# EAGLE design RAMPSXB (EAGLE 8.1.1)
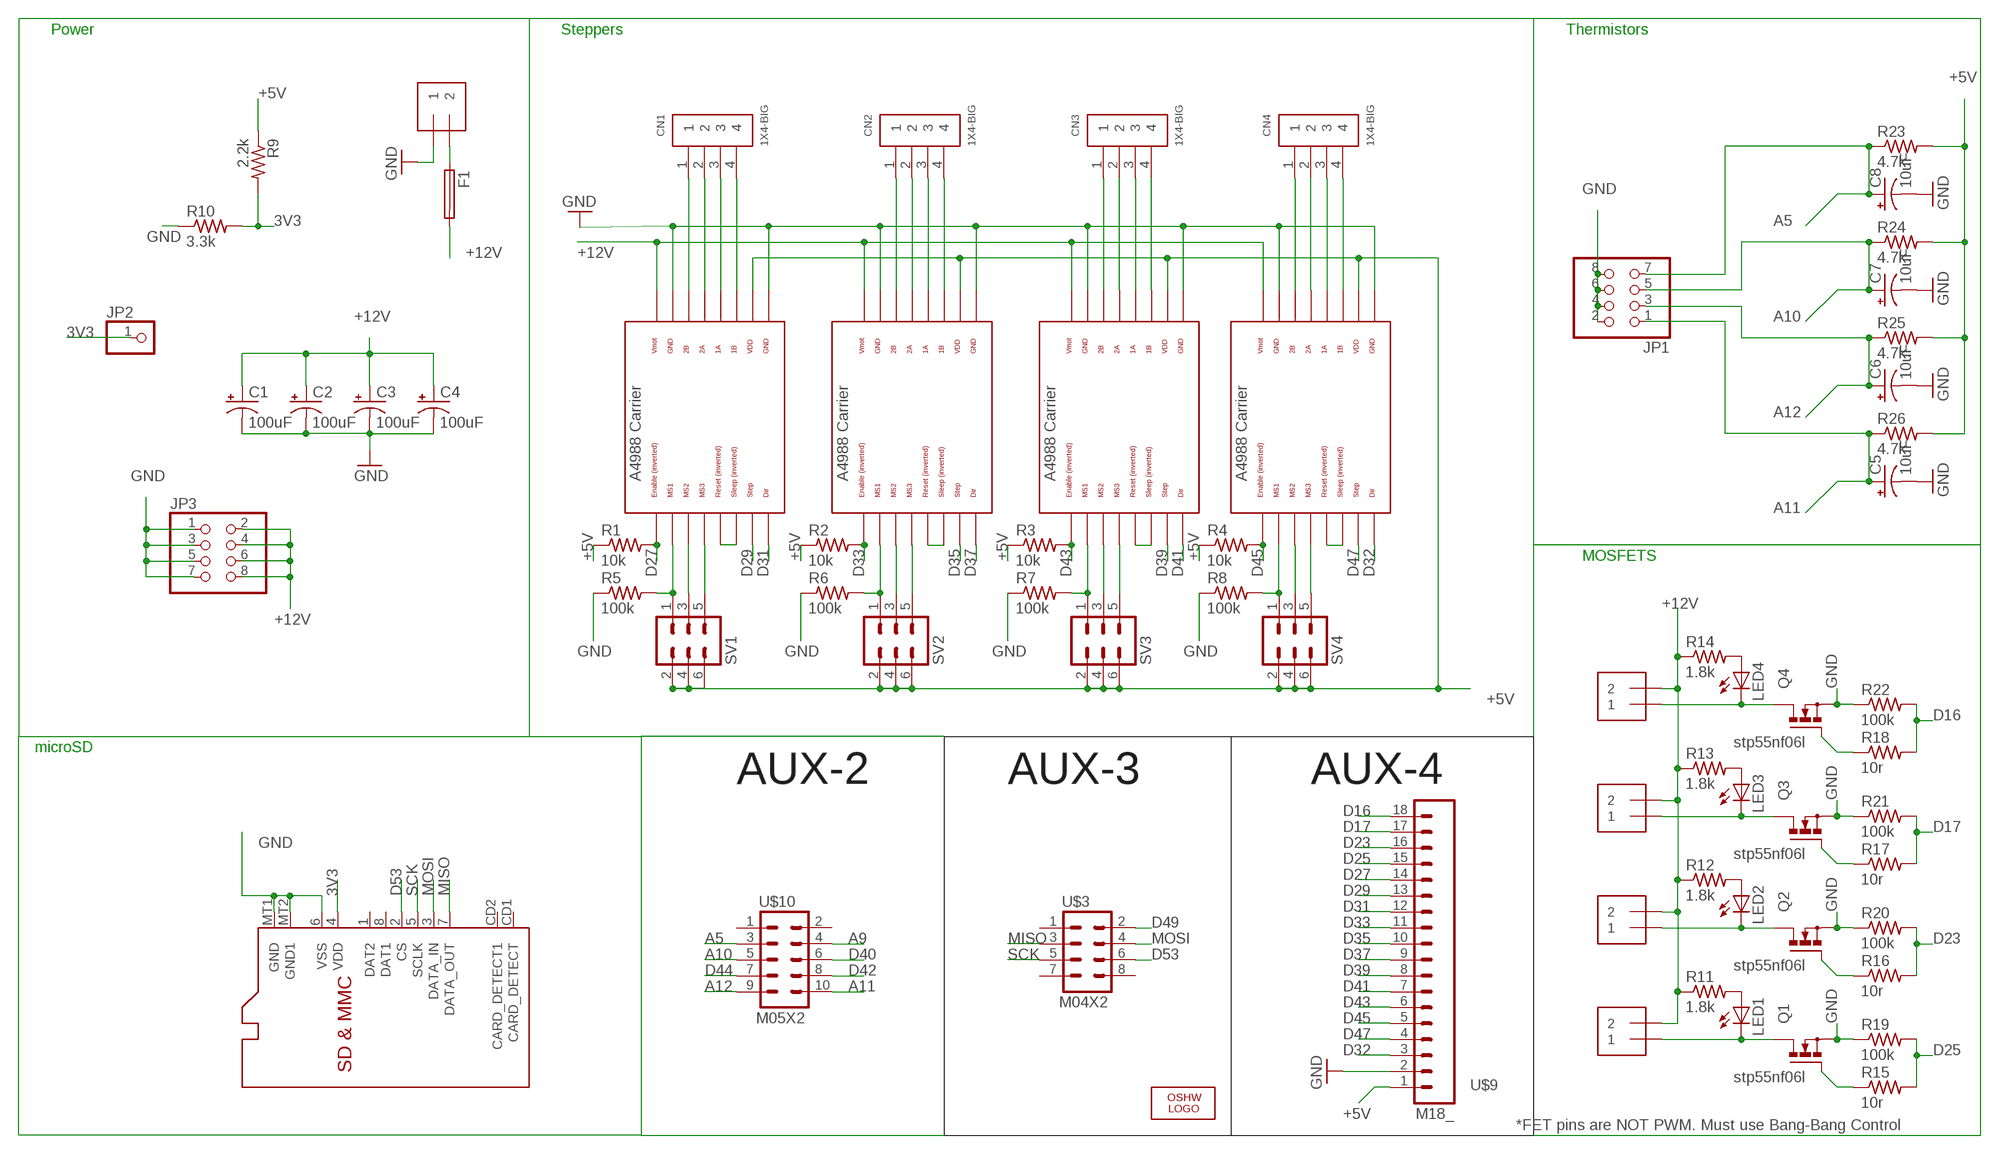
[diagram p0: schematic, sheet 1]

## Parts
C1  100uF  CPOL-US153CLV-0605  [153CLV-0605]
C2  100uF  CPOL-US153CLV-0605  [153CLV-0605]
C3  100uF  CPOL-US153CLV-0605  [153CLV-0605]
C4  100uF  CPOL-US153CLV-0605  [153CLV-0605]
C5  10uF  CPOL-US153CLV-0405  [153CLV-0405]
C6  10uF  CPOL-US153CLV-0405  [153CLV-0405]
C7  10uF  CPOL-US153CLV-0405  [153CLV-0405]
C8  10uF  CPOL-US153CLV-0405  [153CLV-0405]
CN1  1X4-BIG  [1X04-BIG]
CN2  1X4-BIG  [1X04-BIG]
CN3  1X4-BIG  [1X04-BIG]
CN4  1X4-BIG  [1X04-BIG]
F1  SH22,5  [SH22,5]
J1  1X2-3.5MM  [1X2-3.5MM]
J2  1X2-3.5MM  [1X2-3.5MM]
J3  1X2-3.5MM  [1X2-3.5MM]
J4  1X2-3.5MM  [1X2-3.5MM]
J5  1X2-3.5MM  [1X2-3.5MM]
JP1  PINHD-2X4  [2X04]
JP2  PINHD-1X1  [1X01]
JP3  PINHD-2X4  [2X04]
LED1  LEDCHIPLED_0805  [CHIPLED_0805]
LED2  LEDCHIPLED_0805  [CHIPLED_0805]
LED3  LEDCHIPLED_0805  [CHIPLED_0805]
LED4  LEDCHIPLED_0805  [CHIPLED_0805]
LOGO1  OSHW_LOGO_6MILX0100-NT  [OSHW_6X100_NOTEXT]
Q1  IRF512  [TO220BV]
Q2  IRF512  [TO220BV]
Q3  IRF512  [TO220BV]
Q4  IRF512  [TO220BV]
R1  10k  R-US_M0805  [M0805]
R2  10k  R-US_M0805  [M0805]
R3  10k  R-US_M0805  [M0805]
R4  10k  R-US_M0805  [M0805]
R5  100k  R-US_M0805  [M0805]
R6  100k  R-US_M0805  [M0805]
R7  100k  R-US_M0805  [M0805]
R8  100k  R-US_M0805  [M0805]
R9  2.2k  R-US_M1206  [M1206]
R10  3.3k  R-US_M1206  [M1206]
R11  1.8k  R-US_M0805  [M0805]
R12  1.8k  R-US_M0805  [M0805]
R13  1.8k  R-US_M0805  [M0805]
R14  1.8k  R-US_M0805  [M0805]
R15  10r  R-US_M0805  [M0805]
R16  10r  R-US_M0805  [M0805]
R17  10r  R-US_M0805  [M0805]
R18  10r  R-US_M0805  [M0805]
R19  100k  R-US_M0805  [M0805]
R20  100k  R-US_M0805  [M0805]
R21  100k  R-US_M0805  [M0805]
R22  100k  R-US_M0805  [M0805]
R23  4.7k  R-US_R0805  [R0805]
R24  4.7k  R-US_R0805  [R0805]
R25  4.7k  R-US_R0805  [R0805]
R26  4.7k  R-US_R0805  [R0805]
SV1  MA03-2  [MA03-2]
SV2  MA03-2  [MA03-2]
SV3  MA03-2  [MA03-2]
SV4  MA03-2  [MA03-2]
U$1  POLOLU_A4983CARRIER  [A4988BREAKOUT]
U$2  POLOLU_A4983CARRIER  [A4988BREAKOUT]
U$3  M04X2  [2X4]
U$4  POLOLU_A4983CARRIER  [A4988BREAKOUT]
U$5  POLOLU_A4983CARRIER  [A4988BREAKOUT]
U$6  MICROSD  [MICROSD]
U$9  M18_  [1X18]
U$10  M05X2  [2X5]

## Nets
3V3: JP2.1 R9.2 R10.2 U$6.4(VDD)
+5V: R1.1 R2.1 R3.1 R4.1 R9.1 R23.2 R24.2 R25.2 R26.2 SV1.2 SV1.4 SV1.6 SV2.2 SV2.4 SV2.6 SV3.2 SV3.4 SV3.6 SV4.2 SV4.4 SV4.6 U$1.VDD U$2.VDD U$4.VDD U$5.VDD U$9.1
+12V: C1.+ C2.+ C3.+ C4.+ F1.2 J2.2 J3.2 J4.2 J5.2 JP3.2 JP3.4 JP3.6 JP3.8 R11.1 R12.1 R13.1 R14.1 U$1.VMOT U$2.VMOT U$4.VMOT U$5.VMOT
A5: C8.+ JP1.7 R23.1 U$10.3
A9: U$10.4
A10: C7.+ JP1.5 R24.1 U$10.5
A11: C5.+ JP1.1 R26.1 U$10.10
A12: C6.+ JP1.3 R25.1 U$10.9
D16: R18.2 R22.2 U$9.18
D17: R17.2 R21.2 U$9.17
D23: R16.2 R20.2 U$9.16
D25: R15.2 R19.2 U$9.15
D27: R1.2 U$1.EN U$9.14
D29: U$1.STEP U$9.13
D31: U$1.DIR U$9.12
D32: U$5.DIR U$9.3
D33: R2.2 U$2.EN U$9.11
D35: U$2.STEP U$9.10
D37: U$2.DIR U$9.9
D39: U$4.STEP U$9.8
D40: U$10.6
D41: U$4.DIR U$9.7
D42: U$10.8
D43: R3.2 U$4.EN U$9.6
D44: U$10.7
D45: R4.2 U$5.EN U$9.5
D47: U$5.STEP U$9.4
D49: U$3.2
D53: U$3.6 U$6.2(CS)
GND: C1.- C2.- C3.- C4.- C5.- C6.- C7.- C8.- J1.1 JP1.2 JP1.4 JP1.6 JP1.8 JP3.1 JP3.3 JP3.5 JP3.7 Q1.S Q2.S Q3.S Q4.S R5.1 R6.1 R7.1 R8.1 R10.1 R19.1 R20.1 R21.1 R22.1 U$1.GND U$1.GND@0(GND) U$2.GND U$2.GND@0(GND) U$4.GND U$4.GND@0(GND) U$5.GND U$5.GND@0(GND) U$6.6(VSS) U$6.MT1(GND) U$6.MT2(GND1) U$9.2
MISO: U$3.3 U$6.7(DATA_OUT)
MOSI: U$3.4 U$6.3(DATA_IN)
N$1: CN1.1 U$1.2B
N$2: CN1.2 U$1.2A
N$3: CN1.3 U$1.1A
N$4: CN1.4 U$1.1B
N$5: CN2.1 U$2.2B
N$6: CN2.2 U$2.2A
N$7: CN2.3 U$2.1A
N$8: CN2.4 U$2.1B
N$9: CN3.1 U$4.2B
N$10: CN3.2 U$4.2A
N$11: CN3.3 U$4.1A
N$12: CN3.4 U$4.1B
N$13: CN4.1 U$5.2B
N$14: CN4.2 U$5.2A
N$15: CN4.3 U$5.1A
N$16: CN4.4 U$5.1B
N$17: F1.1 J1.2
N$18: R5.2 SV1.1 U$1.MS1
N$19: SV1.3 U$1.MS2
N$20: SV1.5 U$1.MS3
N$21: R6.2 SV2.1 U$2.MS1
N$22: SV2.3 U$2.MS2
N$23: SV2.5 U$2.MS3
N$24: R7.2 SV3.1 U$4.MS1
N$25: SV3.3 U$4.MS2
N$26: SV3.5 U$4.MS3
N$27: R8.2 SV4.1 U$5.MS1
N$28: SV4.3 U$5.MS2
N$29: SV4.5 U$5.MS3
N$30: J2.1 LED1.C Q1.D
N$32: U$2.RST U$2.SLP(SLEEP)
N$33: U$1.RST U$1.SLP(SLEEP)
N$34: U$4.RST U$4.SLP(SLEEP)
N$35: U$5.RST U$5.SLP(SLEEP)
N$36: J3.1 LED2.C Q2.D
N$37: J4.1 LED3.C Q3.D
N$38: J5.1 LED4.C Q4.D
N$39: LED1.A R11.2
N$40: LED2.A R12.2
N$41: LED3.A R13.2
N$42: LED4.A R14.2
N$46: Q2.G R16.1
N$47: Q3.G R17.1
N$48: Q4.G R18.1
N$49: Q1.G R15.1
SCK: U$3.5 U$6.5(SCLK)
Unconnected: U$3.1 U$3.7 U$3.8 U$6.1(DAT2) U$6.8(DAT1) U$6.CD1(CARD_DETECT) U$6.CD2(CARD_DETECT1) U$10.1 U$10.2

## Notes on the sheet
- Power | Steppers | Thermistors
- MOSFETS
- stp55nf06l
- microSD
- AUX-2 | AUX-3 | AUX-4
- stp55nf06l
- stp55nf06l
- stp55nf06l
- *FET pins are NOT PWM. Must use Bang-Bang Control

## Library data of the parts
C1-C8 = adafruit:CPOL-US: POLARIZED CAPACITOR, American symbol
CN1-CN4 = adafruit:1X4: 4-pin connector
F1 = fuse:SH22,5: FUSE HOLDER grid 22,5 mm, OGN0031 8201, Schurter (Buerklin); MF: SCHURTER; MPN: 0031.8201; OC_FARNELL: 1162740; OC_NEWARK: 96F8317
J1-J5 = adafruit:1X2: 3.5mm Terminal block http://www.ladyada.net/library/pcb/eaglelibrary.html
JP1 JP3 = adafruit:PINHD-2X4: PIN HEADER
JP2 = adafruit:PINHD-1X1: Pin header 1x1 for 0.1" spacing With round pins
LED1-LED4 = adafruit:LED: LED OSRAM: - CHIPLED LG R971, LG N971, LY N971, LG Q971, LY Q971, LO R971, LY R971 LH N974, LH R974 LS Q976, LO Q976, LY Q976 LO Q996 - Hyper CHIPLED LW Q18S LB Q993, LB Q99A, LB R99A - SideLED LS A670, LO A670, LY A670, LG A670, LP A670 LB A673, LV A673, LT A673, LW A673 LH A674 LY A675 LS A676, LA A676, LO A676, LY A676, LW A676 LS A679, LY A679, LG A679 - Hyper Micro SIDELED® LS Y876, LA Y876, LO Y876, LY Y876 LT Y87S - SmartLED LW L88C, LW L88S LB L89C, LB L89S, LG L890 LS L89K, LO L89K, LY L89K LS L896, LA L896, LO L896, LY L896 - TOPLED LS T670, LO T670, LY T670, LG T670, LP T670 LSG T670, LSP T670, LSY T670, LOP T670, LYG T670 LG T671, LOG T671, LSG T671 LB T673, LV T673, LT T673, LW T673 LH T674 LS T676, LA T676, LO T676, LY T676, LB T676, LH T676, LSB T676, LW T676 LB T67C, LV T67C, LT T67C, LS T67K, LO T67K, LY T67K, LW E67C LS E67B, LA E67B, LO E67B, LY E67B, LB E67C, LV E67C, LT E67C LW T67C LS T679, LY T679, LG T679 LS T770, LO T770, LY T770, LG T770, LP T770 LB T773, LV T773, LT T773, LW T773 LH T774 LS E675, LA E675, LY E675, LS T675 LS T776, LA T776, LO T776, LY T776, LB T776 LHGB T686 LT T68C, LB T68C - Hyper Mini TOPLED® LB M676 - Mini TOPLED Santana® LG M470 LS M47K, LO M47K, LY M47K Source: http://www.osram.convergy.de/
LOGO1 = OSHW:OSHW_LOGO_6MIL
Q1-Q4 = transistor-power:IRF512: N-CHANNEL MOS FET
R1-R26 = adafruit:R-US_: RESISTOR, American symbol
SV1-SV4 = con-lstb:MA03-2: PIN HEADER; OC_FARNELL: unknown; OC_NEWARK: unknown
U$1 U$2 U$4 U$5 = RAMPS:POLOLU_A4983CARRIER
U$3 = SparkFun:M04X2
U$6 = adafruit:MICROSD: Micro-SD / Transflash card holder with SPI pinout For the 3M # 2908-05WB-MG and/or 4UCON #19656 push-push type
U$9 = SparkFun:M18
U$10 = RepRapjr:M05X2

## Board
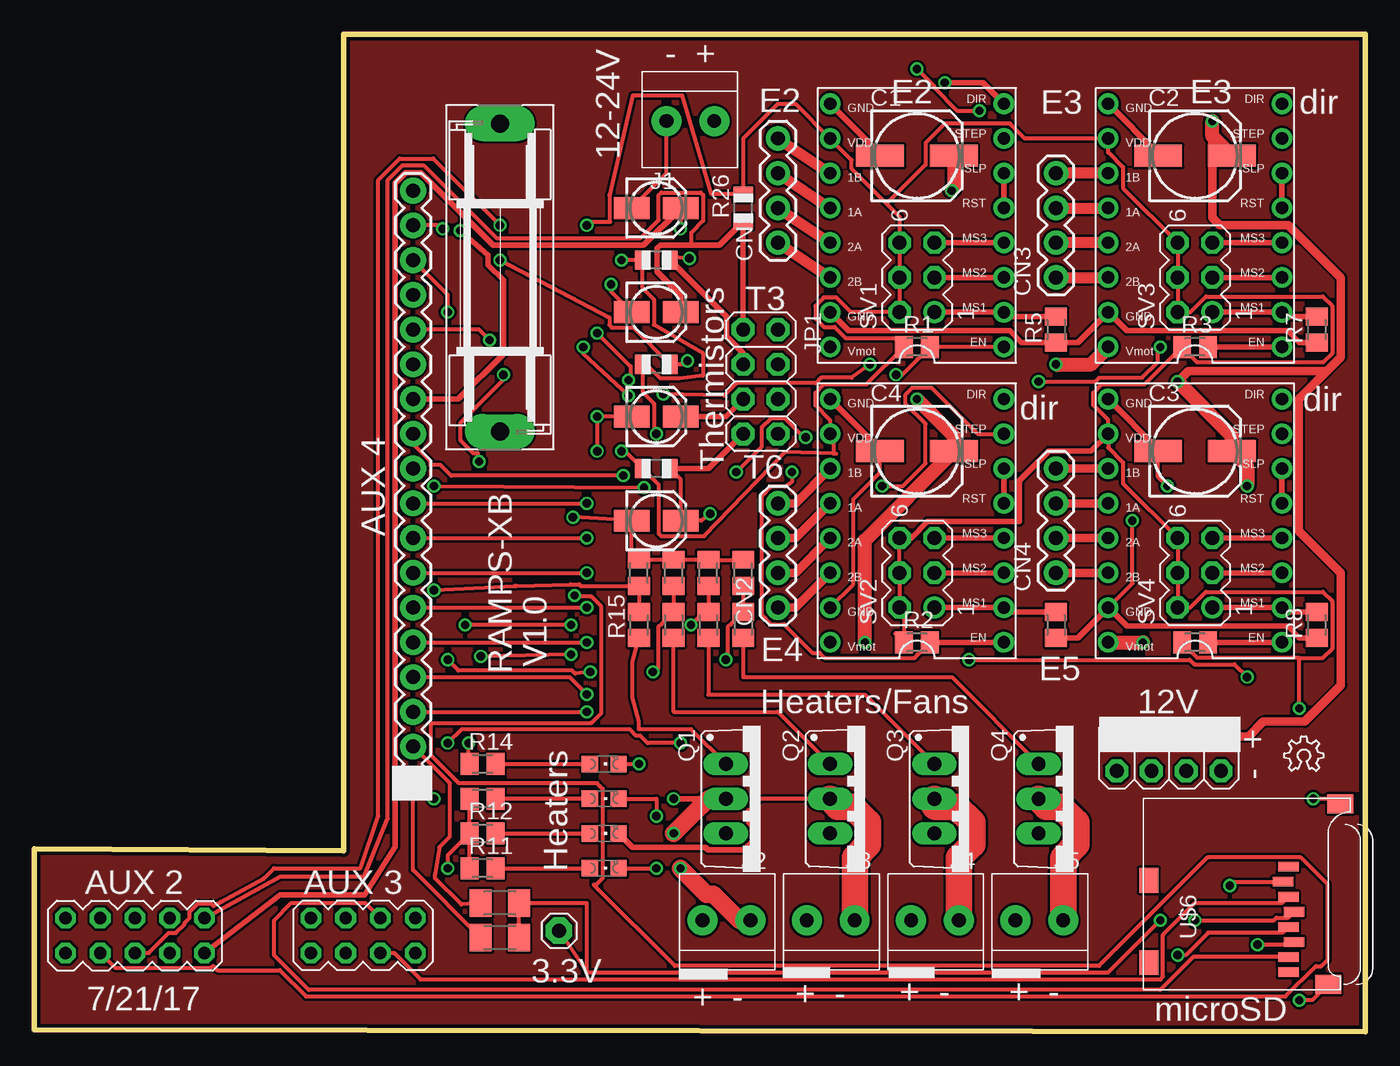
[diagram p1: board, top side]
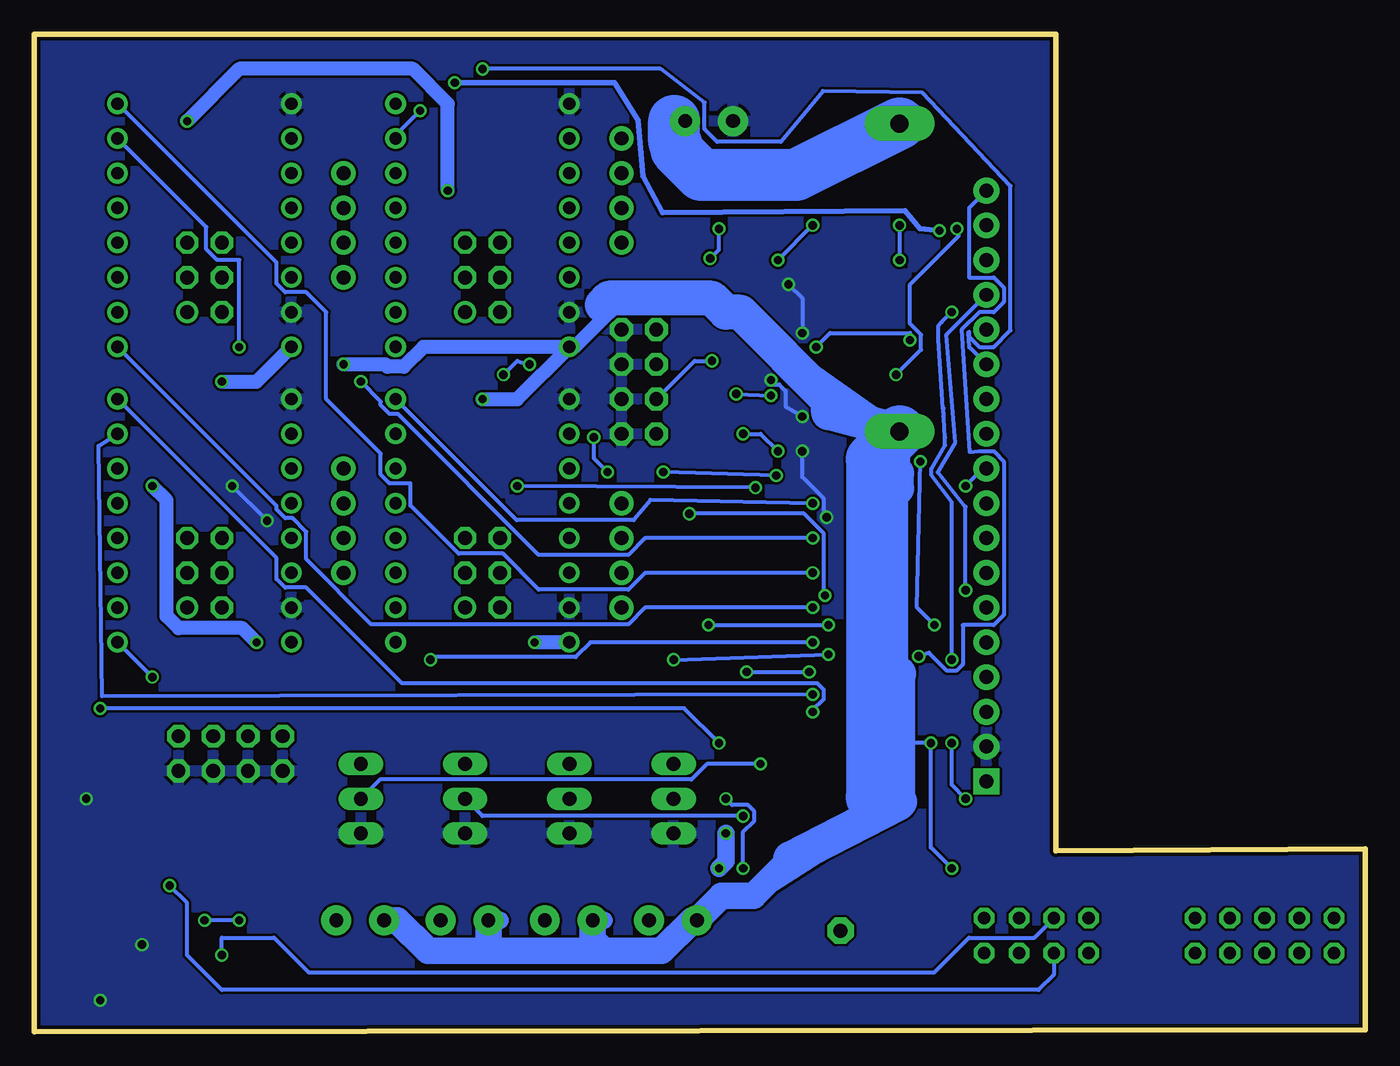
[diagram p2: board, bottom side, seen from below]

Size 97.28 x 72.9 mm. Coordinates in mm from the lower left corner, seen from the top.
Outline: 22.61,72.9 22.61,13.21 0,13.33 0,0.13 97.28,0 97.28,72.9 22.61,72.9
Copper layers (1*16): Top 0.035mm / dielectric 1.5mm / Bottom 0.035mm
Design rules "GoldPhoenix": minimum track width 7mil, minimum drill 15mil, track to track 7mil, track to pad 7mil, pad to pad 7mil, via to via 7mil, smd to smd 7mil, copper to edge 10mil, drill to drill 8mil, minimum pad ring 12mil, minimum via ring 7mil, stop-mask expansion 4mil, vias tented up to drill 25mil, thermal gap 10mil

### Footprints (pad centres in the part's own frame; a part is rotated, then mirrored left to right if it is on the bottom)
153CLV-0605 = smd 3.5 x 1.6: + 2.7,0; - -2.7,0
153CLV-0405 = smd 2.6 x 1.6: + 1.8,0; - -1.8,0
1X04-BIG = drill 1.016 pad 1.778: 1 0,0; 2 2.54,0; 3 5.08,0; 4 7.62,0
SH22,5 = drill 1.321 pad 2.54 long: 1 -11.252,0; 2 11.252,0
1X2-3.5MM = drill 1 pad 2.184: 1 1.8,0; 2 -1.7,0
2X04 = drill 1.016 pad 1.676 octagon: 1 -3.81,-1.27; 2 -3.81,1.27; 3 -1.27,-1.27; 4 -1.27,1.27; 5 1.27,-1.27; 6 1.27,1.27; 7 3.81,-1.27; 8 3.81,1.27
1X01 = drill 1.016 pad 1.93 octagon: 1 0,0
CHIPLED_0805 = smd 1.2 x 1.2: A 0,-1.05; C 0,1.05
TO220BV = drill 1.016 long: D 0,-2.54; G -2.54,-2.54; S 2.54,-2.54
M0805 = smd 1.3 x 1.6: 1 -0.95,0; 2 0.95,0
M1206 = smd 1.6 x 2: 1 -1.4,0; 2 1.4,0
R0805 = smd 1.1 x 1.4: 1 -1,0; 2 1,0
MA03-2 = drill 1.016: 1 -2.54,-1.27 | drill 1.016 octagon: 2 -2.54,1.27; 3 0,-1.27; 4 0,1.27; 5 2.54,-1.27; 6 2.54,1.27
A4988BREAKOUT = drill 0.9: 1A 8.89,1.27; 1B 11.43,1.27; 2A 6.35,1.27; 2B 3.81,1.27; DIR 16.51,-11.43; EN -1.27,-11.43; GND 16.51,1.27; GND@0 1.27,1.27; MS1 1.27,-11.43; MS2 3.81,-11.43; MS3 6.35,-11.43; RST 8.89,-11.43; SLP 11.43,-11.43; STEP 13.97,-11.43; VDD 13.97,1.27; VMOT -1.27,1.27
2X4 = drill 0.9 pad 1.422 octagon: 1 -3.81,-1.27; 2 -3.81,1.27; 3 -1.27,-1.27; 4 -1.27,1.27; 5 1.27,-1.27; 6 1.27,1.27; 7 3.81,-1.27; 8 3.81,1.27
MICROSD = smd 0.7 x 1.5: 1 9,-10.64; 2 7.9,-10.24; 3 6.8,-10.64; 4 5.7,-11.04; 5 4.6,-10.64; 6 3.5,-11.04; 7 2.4,-10.64; 8 1.3,-10.64 | smd 1.8 x 1.4: CD1 2,-0.44; CD2 8,-0.44 | smd 1.4 x 1.9: MT1 0.4,-13.54; MT2 13.6,-14.44
1X18 = drill 1.016 pad 1.88 square: 1 0,0 | drill 1.016 pad 1.88: 2 2.54,0; 3 5.08,0; 4 7.62,0; 5 10.16,0; 6 12.7,0; 7 15.24,0; 8 17.78,0; 9 20.32,0; 10 22.86,0; 11 25.4,0; 12 27.94,0; 13 30.48,0; 14 33.02,0; 15 35.56,0; 16 38.1,0; 17 40.64,0; 18 43.18,0
2X5 = drill 0.9 pad 1.422 octagon: 1 -3.81,-1.27; 2 -3.81,1.27; 3 -1.27,-1.27; 4 -1.27,1.27; 5 1.27,-1.27; 6 1.27,1.27; 7 3.81,-1.27; 8 3.81,1.27; 9 6.35,-1.27; 10 6.35,1.27

### Placement (x,y rotation side)
C1  64.52,64.01 0 top
C2  84.84,64.01 0 top
C3  84.84,42.42 0 top
C4  64.52,42.42 0 top
C5  45.47,52.58 0 top
C6  45.47,60.2 0 top
C7  45.47,44.96 0 top
C8  45.47,37.34 0 top
CN1  54.36,57.66 90 top
CN2  54.36,30.99 90 top
CN3  74.68,55.12 90 top
CN4  74.68,33.53 90 top
F1  34.04,55.12 270 top
J1  48.01,66.55 180 top
J2  50.55,8.13 0 top
J3  58.17,8.13 0 top
J4  65.79,8.13 0 top
J5  73.41,8.13 0 top
JP1  53.09,47.5 270 top
JP2  38.35,7.37 0 top
JP3  82.93,20.32 0 top
LED1  41.66,11.94 270 top
LED2  41.66,14.48 270 top
LED3  41.66,17.02 270 top
LED4  41.66,19.56 270 top
LOGO1  91.38,19.05 0 top
Q1  53.09,17.02 270 top
Q2  60.71,17.02 270 top
Q3  68.33,17.02 270 top
Q4  75.95,17.02 270 top
R1  64.52,50.04 0 top
R2  64.52,28.45 0 top
R3  84.84,50.04 0 top
R4  84.84,28.45 0 top
R5  74.68,51.31 90 top
R6  74.68,29.72 90 top
R7  93.73,51.31 90 top
R8  93.73,29.72 90 top
R9  34.04,6.86 0 top
R10  34.04,9.4 0 top
R11  32.77,11.94 0 top
R12  32.77,14.48 0 top
R13  32.77,17.02 0 top
R14  32.77,19.56 0 top
R15  44.2,29.72 90 top
R16  46.74,29.72 90 top
R17  49.28,29.72 90 top
R18  51.82,29.72 90 top
R19  44.2,33.53 270 top
R20  46.74,33.53 270 top
R21  49.28,33.53 270 top
R22  51.82,33.53 270 top
R23  45.47,41.15 180 top
R24  45.47,48.77 180 top
R25  45.47,56.39 180 top
R26  51.82,60.2 90 top
SV1  64.52,55.12 90 top
SV2  64.52,33.53 90 top
SV3  84.84,55.12 90 top
SV4  84.84,33.53 90 top
U$1  59.44,51.31 90 top
U$2  59.44,29.72 90 top
U$3  24.03,7.02 180 top
U$4  79.76,51.31 90 top
U$5  79.76,29.72 90 top
U$6  81.03,3.05 90 top
U$9  27.69,18.29 90 top
U$10  6.1,7.02 0 top

### Tracks (layer width: path | path; a pad name or v marks a point on that pad's centre or on a via)
3V3  (via drill 0.6)
  Top 0.305: R9.2 R10.2 40.39,9.4 40.39,4.32 | 40.39,4.32 78.49,4.32 v82.3,8.13 | U$6.4 91.65,8.33 90.78,8.33 90.58,8.13 v84.84,8.13 | JP2.1 40.39,4.32
  Bottom 0.305: v82.3,8.13 v84.84,8.13
+5V  (via drill 0.6)
  Top 0.305: R9.1 27.69,11.81 U$9.1 28.96,17.02 v29.21,17.02 | 62.29,60.52 63.25,59.56 SV1.6 SV1.4 SV1.2 59.7,52.58 58.61,53.66 57.72,53.66 57.08,53.03 57.08,52.13 57.72,51.49 58.5,51.49 59.3,50.69 62.92,50.69 R1.1 60.84,47.31 57.72,47.31 57.08,46.68 57.08,45.78 58.17,44.69 U$2.VDD 58.42,43.43 58.42,42.23 | 62.29,60.52 59.74,63.07 59.74,63.71 U$1.VDD 55.63,67.82 54.36,67.82 51.82,65.28 R26.2 49.52,61.2 47.38,68.42 43.73,68.42 42.04,61.13 42.04,59.26 | 83.87,50.04 85,48.91 94.19,48.91 94.86,49.57 94.86,53.04 94.18,53.72 85.63,53.72 84.49,52.58 SV3.2 SV3.4 SV3.6 79.57,61.65 79.57,63.19 78.49,64.27 U$4.VDD 72.4,65.28 71.31,66.36 66.55,66.36 65.14,64.95 65.14,63.36 62.29,60.52 | 83.57,50.04 83.87,50.04 | 83.87,50.04 R3.1 81.16,47.31 78.04,47.31 77.4,46.68 77.4,45.78 78.49,44.69 U$5.VDD 78.49,42.68 79.57,41.6 79.57,40.06 SV4.6 SV4.4 SV4.2 84.49,30.99 85.63,32.13 94.18,32.13 94.86,31.46 94.86,27.98 94.19,27.32 92.46,27.32 | R4.1 83.89,28.43 85,27.32 92.46,27.32 | SV2.6 SV2.4 SV2.2 63.57,30.67 R2.1 62.92,29.1 | 58.42,42.23 54.85,42.36 48.96,36.21 45.83,36.21 45.64,36.4 45.64,39.98 R23.2 43.2,42.42 v42.93,42.42 | 58.42,42.23 58.61,42.23 | v45.47,43.69 45.3,43.86 45.3,45.89 44.47,46.72 R24.2 44.75,48.77 45.78,47.74 47.15,47.74 48.87,47.93 48.87,49.6 45.3,51.66 45.3,53.52 44.47,54.34 R25.2 v42.93,56.39 | v40.39,58.93 40.64,59.18 42.11,59.18 | v92.46,23.62 92.46,27.32 | v30.23,21.08 31.22,22.08 43.53,22.08 44,21.62 44.3,21.62 44.83,21.08 v47.24,21.08
  Top 0.406: SV2.6 64.1,36.07 65.29,37.26 72,37.26 72,40.27 74.15,42.42 77.22,42.42 U$5.VDD
  Bottom 0.305: v45.47,43.69 44.2,43.69 v42.93,42.42 | v40.39,58.93 v42.93,56.39 | v29.21,17.02 30.23,18.03 v30.23,21.08 | v47.24,21.08 49.78,23.62 v92.46,23.62
+12V  (via drill 0.6)
  Top 0.305: R11.1 R12.1 | R12.1 R13.1 31.82,17.67 | R14.1 31.75,19.62 v31.75,21.08 | R12.1 30.23,12.89 v30.23,11.94
  Top 0.61: 94.46,48.27 95.49,49.31 95.49,55.1 91.64,58.95 86.64,58.95 86.11,59.49 v86.11,66.55 | 94.46,48.27 84.34,48.27 v83.57,47.5 | 94.46,48.27 92.42,46.24 92.42,36.58 95.49,33.51 95.49,25.3 92.85,22.66 89.84,22.66 88.77,21.59 JP3.8 JP3.6 JP3.4 JP3.2
  Top 1.016: v74.68,48.77 77.22,48.77 U$4.VMOT | U$5.VMOT v81.03,28.45 | v88.65,39.88 88.65,41.31 C3.+ 87.54,43.53 v83.57,47.5 | v60.71,28.45 60.71,35.91 C4.+ 67.22,43.53 v64.52,46.23 | C1.+ 67.22,61.63 v67.06,61.47 | v86.11,66.55 86.11,65.44 C2.+
  Bottom 0.305: 34.04,21.08 v31.75,21.08 31.75,13.46 v30.23,11.94
  Bottom 1.016: U$1.VMOT 57.78,50.04 54.99,52.83 46.81,52.83 F1.2 | U$1.VMOT 68.83,50.04 70.27,48.6 71.46,48.6 71.63,48.77 v74.68,48.77 | v88.65,39.88 87.61,38.84 87.61,30.37 86.73,29.49 82.07,29.49 v81.03,28.45 | v83.57,47.5 81.03,47.5 U$4.VMOT | U$2.VMOT v60.71,28.45 | v64.52,46.23 61.98,46.23 U$1.VMOT | v67.06,61.47 67.06,67.82 69.6,70.36 82.3,70.36 v86.11,66.55
  Bottom 1.27: 34.16,16.66 44.73,9.91 | 34.04,16.79 34.04,21.08 F1.2 | J3.2 55.63,8.13 | J4.2 63.25,8.13 | J5.2 70.87,8.13
  Bottom 1.93: J5.2 70.75,8.13 68.51,5.89 64.01,5.89 | 55.63,5.89 51.42,5.89 49.18,8.13 J2.2 47.07,9.91 44.73,9.91 42.29,12.34 42.29,12.7 | 55.63,5.89 64.01,5.89 | 64.01,5.89 64.09,5.97 J4.2 | 55.63,5.89 56.47,6.73 J3.2
  Bottom 2.54: 41.99,12.65 34.16,16.66 | 34.16,16.66 34.16,26.11 34.1,26.17 | 34.27,39.7 34.25,40.8 34.56,41.11 34.56,42.71 34.04,43.24 F1.2 39.22,45.24 39.22,46.14 45.66,52.58 46.74,52.58 47.75,53.59 55.3,53.59 55.78,53.11 | 34.04,16.79 34.16,16.66
  Bottom 3.81: F1.2 36.07,41.83 36.07,17.14
A5  (via drill 0.6)
  Top 0.305: R23.1 47.27,40.35 C8.+ 48.77,37.34 v49.4,37.85 | v39.5,31.88 39.16,31.8 40.72,31.8 41.45,31.07 41.45,23.29 40.72,22.56 29,22.56 29,20.2 31.05,18.15 41.14,18.15 41.54,17.76 41.54,11.2 41.06,10.73 40.89,10.73 46.81,4.8 77.83,4.8 85.75,12.73 92.55,12.73 94.53,10.75 94.53,5.25 94.06,4.78 93.67,4.78 91.45,2.56 19.87,2.56 17.95,4.48 13.39,4.48 13.07,4.8 12.89,4.66 5.91,4.66 U$10.3
  Top 0.406: R23.1 49.28,41.15 JP1.7
  Bottom 0.305: v39.5,31.88 39.58,32.21 39.58,36.4 41.02,37.85 v49.4,37.85
A10  (via drill 0.6)
  Top 0.305: U$10.5 8.37,5.75 9.83,7.2 10.35,7.2 10.99,7.84 10.99,7.94 11.36,8.31 11.36,8.74 12,9.37 12.89,9.37 13.08,9.18 13.66,9.5 16.79,11.21 17.53,11.94 23.85,11.94 25.12,15.72 25.15,15.75 25.15,62.23 26.72,63.8 29.16,63.8 v34.04,58.93 | v34.04,56.39 42.04,52.2 42.04,51.64 42.23,51.45 43.79,51.45 R24.1 47.5,48.77 v47.75,49.02
  Top 0.406: C7.+ 50.55,44.96 JP1.5
  Bottom 0.305: v34.04,58.93 v34.04,56.39 | JP1.5 49.02,49.02 v47.75,49.02
A11
  Top 0.305: U$10.10 18.03,11.33 24.13,11.33 25.83,15.57 25.83,62.24 26.92,63.32 28.45,63.32 33.77,58 44.32,58 45.64,59.32 45.64,61.13 45.83,61.33 48.7,61.33 48.9,61.13 48.9,59.26 48.01,58.37 48.01,57.47
  Top 0.406: JP1.1 R26.1 50.09,57.47 48.01,57.47 45.76,57.47 45.53,57.25 45.53,55.53 47.27,53.8 C5.+
A12  (via drill 0.6)
  Top 0.305: R25.1 46.72,56.64 v47.88,56.52 | v47.24,58.67 47.27,58.7 C6.+
  Top 0.406: JP1.3 51.82,49.58 50.6,50.8 50.6,52.26 R25.1 | C6.+ 44.54,57.47 33.55,57.47 28.23,62.79 27.14,62.79 26.37,62.02 26.37,13.49 24.15,10.01 17.98,10.01 U$10.9
  Bottom 0.305: v47.88,56.52 47.24,57.15 v47.24,58.67
D16  (via drill 0.6)
  Top 0.305: R22.2 R18.2 50.9,29.75 50.88,29.75 50.69,29.55 50.69,27.32 v50.55,27.18 | v39.24,27.56 v32.64,27.43
  Bottom 0.305: v50.55,27.18 v39.24,27.56 | U$9.18 28.96,60.2 28.96,55.12 27.16,55.12 26.42,54.37 26.42,53.32 27.16,52.58 28.21,52.58 29.5,51.29 28.93,42.37 28.21,42.42 27.16,42.42 26.42,41.67 26.42,30.46 27.16,29.72 29.42,29.72 29.42,26.84 29.89,26.37 30.56,26.37 31.88,27.69 v32.64,27.43
D17  (via drill 0.6)
  Top 0.305: R21.2 R17.2 48.96,30.67 v48.01,29.72 | v39.24,29.72 v31.5,29.72 | v32.51,41.66 32.41,42.27 32.1,42.27 31.17,43.2 31.17,44.53 34.29,47.65 v34.29,48.01 | v29.85,58.67 29.46,58.93 U$9.17
  Bottom 0.305: v48.01,29.72 v39.24,29.72 | v31.5,29.72 32.77,30.99 v32.51,41.66 | v34.29,48.01 32.47,49.83 32.47,50.93 33.27,51.74 33.27,54.61 29.72,58.17 v29.85,58.67
D23  (via drill 0.6)
  Top 0.305: R20.2 R16.2 45.82,29.75 45.8,29.75 45.61,29.55 45.61,26.56 v45.21,26.29 | v40.64,26.29 39.54,26.16 39.32,26.39 31.01,26.39 v30.23,27.18 | U$9.16 30.23,53.85 v30.23,52.58
  Bottom 0.305: v45.21,26.29 v40.64,26.29 | v30.23,27.18 30.23,38.69 31.73,40.69 31.73,41.15 30.72,42.85 30.72,43.43 30.82,45.55 30.83,45.55 30.88,45.55 | 30.88,45.55 31.2,50.59 31.22,50.6 31.22,50.78 31.23,50.97 31.22,50.98 31.22,51.55 30.96,51.84 v30.23,52.58 | 30.88,45.55 | 30.88,45.55 30.84,44.98
D25  (via drill 0.6)
  Top 0.305: R15.2 R19.2 39.94,32.58 39.83,32.68 39.16,32.68 35.24,32.58 35.12,32.58 v29.21,32.26
  Bottom 0.305: v29.21,32.26 29.21,38.35 31.24,40.89 29.97,43.05 30.61,50.93 U$9.15
D27  (via drill 0.6)
  Top 0.305: U$1.EN R1.2 64.55,49.12 64.55,49.1 63.45,48.01 v62.99,48.01 | v61.09,48.77 59.73,47.8 57.52,47.8 57.12,47.4 51.33,47.4 50.42,46.48 v45.97,46.61 | v43.43,46.48 40.13,49.53 v40.13,50.04 | v33.27,50.55 32.51,51.31 U$9.14
  Bottom 0.305: v62.99,48.01 61.98,49.02 v61.09,48.77 | v45.97,46.61 v43.43,46.48 | v40.13,50.04 39.12,51.05 33.27,51.05 v33.27,50.55
D29  (via drill 0.6)
  Top 0.305: v64.52,70.36 65.74,69.13 65.74,69.01 67.44,67.31 v69.09,67.31
  Bottom 0.305: U$9.13 28.93,50.02 29,51.1 28.96,51.15 28.96,50.78 28.21,50.04 27.16,50.04 25.93,51.27 25.93,61.8 32.36,68.61 39.65,68.73 42.71,65.04 47.37,65.04 48.28,65.96 48.28,67.9 51.5,70.36 v64.52,70.36 | v69.09,67.31 70.87,65.53 U$1.STEP
D31  (via drill 0.6)
  Top 0.406: U$9.12 30.99,46.23 34.29,49.53 34.29,54.92 33.18,56.03 33.18,56.74 v31.12,58.55 | v66.55,69.34 69.34,69.34 U$1.DIR
  Bottom 0.406: v31.12,58.55 32.57,58.67 33.63,59.99 51.38,59.87 52.78,62.54 53.16,66.62 54.86,69.34 v66.55,69.34
D32  (via drill 0.6)
  Top 0.305: U$9.3 v40.39,23.37
  Bottom 0.305: U$5.DIR 79.57,34.61 79.57,33.08 78.94,32.44 77.4,32.44 70.4,25.45 40.05,25.45 39.58,24.97 39.58,24.3 40.39,23.5 v40.39,23.37
D33  (via drill 0.6)
  Top 0.305: U$9.11 27.69,42.94 28.96,41.67 28.96,41.4 29.72,41.4 30.48,40.64 v43.05,40.64 | v51.31,40.89 53.19,42.77 53.19,44.17 53.87,44.86 54.84,44.86 56.26,43.43 v56.39,43.43 | v55.37,40.89 55.37,40.17 54.86,39.83 53.85,39.83 53.14,39.11 53.14,30.48 53.85,29.77 54.81,29.77 56.9,27.69 57.39,27.69 57.76,27.32 64.35,27.32 64.55,27.51 64.55,27.53 R2.2
  Top 0.406: R2.2 U$2.EN
  Bottom 0.305: v56.39,43.43 56.39,41.91 v55.37,40.89 | v43.05,40.64 v51.31,40.89
D35  (via drill 0.6)
  Top 0.305: v61.98,39.88 63.49,39.88 65.14,41.52 65.14,44.42 63.68,45.88 63.68,46.57 64.17,47.07 65.59,47.07 68.96,43.69 U$2.STEP | v29.21,39.88 v44.58,39.75
  Bottom 0.305: U$9.10 27.94,41.15 v29.21,39.88 | v44.58,39.75 v61.98,39.88
D37  (via drill 0.6)
  Top 0.305: U$9.9 v40.39,38.61
  Bottom 0.305: v40.39,38.61 52.25,38.86 53.47,37.39 62.03,37.39 U$2.DIR
D39  (via drill 0.6)
  Top 0.305: U$9.8 v40.39,36.07 | v73.41,47.5 77.54,47.5 77.84,47.8 80.96,47.8 82.12,48.95 82.12,49.86 v82.3,50.04
  Bottom 0.305: v73.41,47.5 71.95,46.04 71.95,45.78 71.31,45.14 70.7,45.14 60.41,34.85 53.85,34.85 52.63,36.07 v40.39,36.07 | v82.3,50.04 82.3,56.39 83.91,56.39 84.71,57.18 84.71,58.8 U$4.STEP
D41  (via drill 0.6)
  Top 0.305: U$9.7 v40.39,33.53
  Bottom 0.305: v40.39,33.53 52.63,33.53 53.85,32.31 60.41,32.31 63.03,34.92 66.26,34.92 69.78,38.45 69.78,40.06 71.31,40.06 71.95,40.7 71.95,42.23 75.95,46.23 75.95,52.58 77.4,54.03 78.94,54.03 79.57,54.67 79.57,56.2 U$4.DIR
D43  (via drill 0.6)
  Top 0.305: U$9.6 v40.39,30.99
  Top 0.406: R3.2 U$4.EN
  Bottom 0.305: U$4.EN 79.57,38.42 79.57,38.16 78.94,37.52 78.41,37.52 77.4,36.52 77.4,34.53 72.64,29.77 53.85,29.77 52.63,30.99 v40.39,30.99
D45  (via drill 0.6)
  Top 0.305: U$9.5 v40.39,28.45 | v68.33,27.18 84.46,27.18 84.8,26.84 87.72,26.84 v88.65,25.91
  Top 0.406: U$5.EN R4.2
  Bottom 0.305: v40.39,28.45 56.63,28.45 57.72,27.36 68.14,27.36 v68.33,27.18 | v88.65,25.91 U$5.EN
D47  (via drill 0.6)
  Top 0.305: U$9.4 39.12,25.91 v40.39,24.64
  Bottom 0.305: v40.39,24.64 92.33,24.51 92.58,42.8 U$5.STEP
D53  (via drill 0.6)
  Top 0.305: v87.38,10.67 87.38,10.95 U$6.2
  Bottom 0.305: U$3.6 22.77,4.16 23.88,3.05 83.57,3.05 86.11,5.59 86.11,9.4 v87.38,10.67
GND  (via drill 0.6)
  Top 0.305: R10.1 31.23,9.28 29.31,11.2 29.31,11.51 29.61,13.5 29.63,13.5 30.35,14.22 30.35,18.16 U$9.2 | 49.28,34.8 R21.1 | R21.1 R20.1 R19.1 43.67,35.01 C8.- v39.37,37.59 | R21.1 R22.1 | U$5.GND@0 80.26,32.77 v80.26,37.34 | v82.8,39.88 82.14,40.55 C3.- | C6.- 46.21,62.74 J1.1 | v41.15,42.42 v41.15,44.96 C7.- | C5.- 42.16,54.08 v42.16,54.61 | v41.15,51.05 43.59,48.62 43.59,47.93 43.69,47.83 v43.43,47.62 | U$2.GND@0 59.87,32.69 59.87,38.91 61.82,40.86 C4.- | U$6.MT2 95.1,17.02 v93.47,17.02 | U$6.6 91.87,6.35 v89.41,6.35 | U$6.MT1 93.4,2.29 v92.46,2.29
  Top 0.406: R6.1 76.27,28.77 U$5.GND@0 79.84,29.63 91.61,29.63 92.47,28.77 R8.1 | R7.1 92.47,50.36 91.61,51.22 79.84,51.22 U$4.GND@0 76.27,50.36 R5.1 72.15,50.36 71.29,51.22 59.52,51.22 U$1.GND@0 | C4.- 61.82,42.58 U$2.GND | C1.- 61.82,64.17 U$1.GND | C2.- 82.14,64.17 U$4.GND | C3.- 82.14,42.58 U$5.GND
  Bottom 0.305: v80.26,37.34 v82.8,39.88 | v39.37,37.59 39.58,37.8 39.58,38.94 41.15,40.51 v41.15,42.42 | v42.16,54.61 41.15,53.59 v41.15,51.05 | v43.43,47.62 43.48,47.29 42.84,47.29 42.37,46.82 42.37,45.67 v41.15,44.96
  pour Bottom: 0,0.13 0,13.33 22.61,13.21 22.61,72.9 97.28,72.9 97.28,0
MISO
  Top 0.305: U$6.7 84.7,5.45 82.3,3.05 20.07,3.05 17.53,5.59 17.53,8.13 18.8,9.4 24.19,9.4 U$3.3
MOSI
  Top 0.305: U$6.3 91.25,9.43 91.18,9.43 91.15,9.4 84.84,9.4 82.5,7.06 82.5,4.01 82.3,3.82 28.24,3.82 26.31,5.75 U$3.4
N$1
  Top 0.813: CN1.1 U$1.2B
N$2
  Top 0.813: CN1.2 U$1.2A
N$3
  Top 0.813: CN1.3 U$1.1A
N$4
  Top 0.813: CN1.4 U$1.1B
N$5
  Top 0.61: U$2.2B 55.63,30.99 CN2.1
N$6
  Top 0.61: U$2.2A 55.63,33.53 CN2.2
N$7
  Top 0.61: U$2.1A 55.63,36.07 CN2.3
N$8
  Top 0.61: U$2.1B 55.63,38.61 CN2.4
N$9
  Top 0.813: CN3.1 U$4.2B
N$10
  Top 0.813: U$4.2A CN3.2
N$11
  Top 0.813: CN3.3 U$4.1A
N$12
  Top 0.813: U$4.1B CN3.4
N$13
  Top 0.61: CN4.1 U$5.2B
N$14
  Top 0.61: U$5.2A CN4.2
N$15
  Top 0.61: CN4.3 U$5.1A
N$16
  Top 0.61: U$5.1B CN4.4
N$17
  Bottom 1.016: J1.2 49.66,66.6 49.66,66.68 50.55,66.68 50.52,66.65 50.52,65.03
  Bottom 3.81: F1.1 41.6,62.61 48.51,62.61 50.36,64.46 50.36,64.88 50.52,65.03 50.52,66.55
N$18
  Top 0.406: SV1.1 U$1.MS1 71.19,52.26 R5.2
N$19
  Top 0.406: SV1.3 U$1.MS2
N$20
  Top 0.406: SV1.5 U$1.MS3
N$21
  Top 0.406: SV2.1 U$2.MS1 71.19,30.67 R6.2
N$22
  Top 0.406: SV2.3 U$2.MS2
N$23
  Top 0.406: SV2.5 U$2.MS3
N$24
  Top 0.406: SV3.1 U$4.MS1 91.51,52.26 R7.2
N$25
  Top 0.406: SV3.3 U$4.MS2
N$26
  Top 0.406: SV3.5 U$4.MS3
N$27
  Top 0.406: SV4.1 U$5.MS1 91.51,30.67 R8.2
N$28
  Top 0.406: SV4.3 U$5.MS2
N$29
  Top 0.406: SV4.5 U$5.MS3
N$30  (via drill 0.6)
  Top 0.305: LED1.C v45.47,11.94
  Top 0.406: v46.74,17.02 Q1.D
  Top 1.27: v47.24,11.94 49.15,10.03 49.63,10.03 51.54,8.13 J2.1 | v46.74,14.48 48.52,16.27 48.65,16.47 48.75,16.49 49.28,17.02 Q1.D
  Bottom 0.305: v46.74,17.02 46.27,16.56 45.13,16.56 44.66,16.08 44.66,15.41 45.47,14.61 v45.47,11.94
  Bottom 1.27: v47.24,11.94 46.74,12.45 v46.74,14.48
N$31
  pour Top: 0,0 0,13.21 22.61,13.21 22.61,72.9 97.28,72.9 97.28,0
N$32
  Top 0.406: U$2.SLP U$2.RST
N$33
  Top 0.406: U$1.SLP U$1.RST
N$34
  Top 0.406: U$4.RST U$4.SLP
N$35
  Top 0.406: U$5.SLP U$5.RST
N$36
  Top 0.305: 52.2,16.13 53.09,17.02 Q2.D
  Top 0.406: LED2.C 43.72,13.46 49.06,13.46 49.24,13.28 51.85,13.28 52.55,13.98 52.55,14.97 52.2,15.33 52.2,16.13
  Top 1.93: Q2.D 58.75,16.43 59.79,16.43 60.93,15.29 60.93,13.67 59.97,12.7 J3.1
N$37  (via drill 0.6)
  Top 0.305: LED3.C 45.47,17.02 v45.47,15.75
  Top 1.93: 66.37,16.43 65.86,16.43 65.79,16.51 | 66.37,16.43 67.41,16.43 68.56,15.29 68.56,13.67 67.59,12.7 J4.1 | 66.37,16.43 Q3.D
  Bottom 0.305: v45.47,15.75 64.52,15.75 Q3.D
N$38  (via drill 0.6)
  Top 0.305: LED4.C v44.2,19.56
  Top 1.93: Q4.D 73.99,16.43 75.03,16.43 76.18,15.29 76.18,13.67 75.21,12.7 J5.1
  Bottom 0.305: v44.2,19.56 48.12,19.56 49.26,18.42 72.01,18.42 Q4.D
N$39
  Top 0.305: R11.2 LED1.A
N$40
  Top 0.305: R12.2 LED2.A
N$41
  Top 0.305: LED3.A R13.2
N$42
  Top 0.305: R14.2 LED4.A
N$46
  Top 0.305: R16.1 46.74,23.37 54.36,23.37 Q2.G
N$47
  Top 0.305: R17.1 49.28,24.64 60.71,24.64 Q3.G
N$48
  Top 0.305: R18.1 51.82,25.91 67.06,25.91 Q4.G
N$49
  Top 0.305: Q1.G 48.01,22.1 44.2,22.1 44.2,22.69 43.71,24.44 43.71,27.02 R15.1
SCK  (via drill 0.6)
  Top 0.305: v83.57,5.59 84.15,5.59 85.79,7.23 91.25,7.23 U$6.5
  Bottom 0.305: v83.57,5.59 83.57,6.86 79.76,6.86 77.22,4.32 31.5,4.32 28.96,6.86 24.19,6.86 U$3.5

### Text on the board
tPlace: - + | E2 | E3 | dir | 12-24V | T3 | dir | dir | AUX 4 | Thermistors | T6 | E4 | RAMPS-XB | V1.0 | Heaters/Fans | E5 | 12V | - + | AUX 2 | AUX 3 | Heaters | 3.3V | + - | + - | + - | microSD | 7/21/17 | + -
tSilk: E2 | E3